# Altium schematic sheet External_Camera_HAT_Peripherals.SchDoc: Peripherals
size B; Date: 1/18/2024; Author: Robert Pafford; Organization: ORGANIZATION; Address1: ADDRESS 1; Address2: ADDRESS 2; Address3: ADDRESS 3; Address4: ADDRESS 4; Revision: -; SheetNumber: 3; SheetTotal: 4; ENG_APP_DATE: --/--/--; DSN_APP_DATE: --/--/--; CHK_APP_DATE: --/--/--
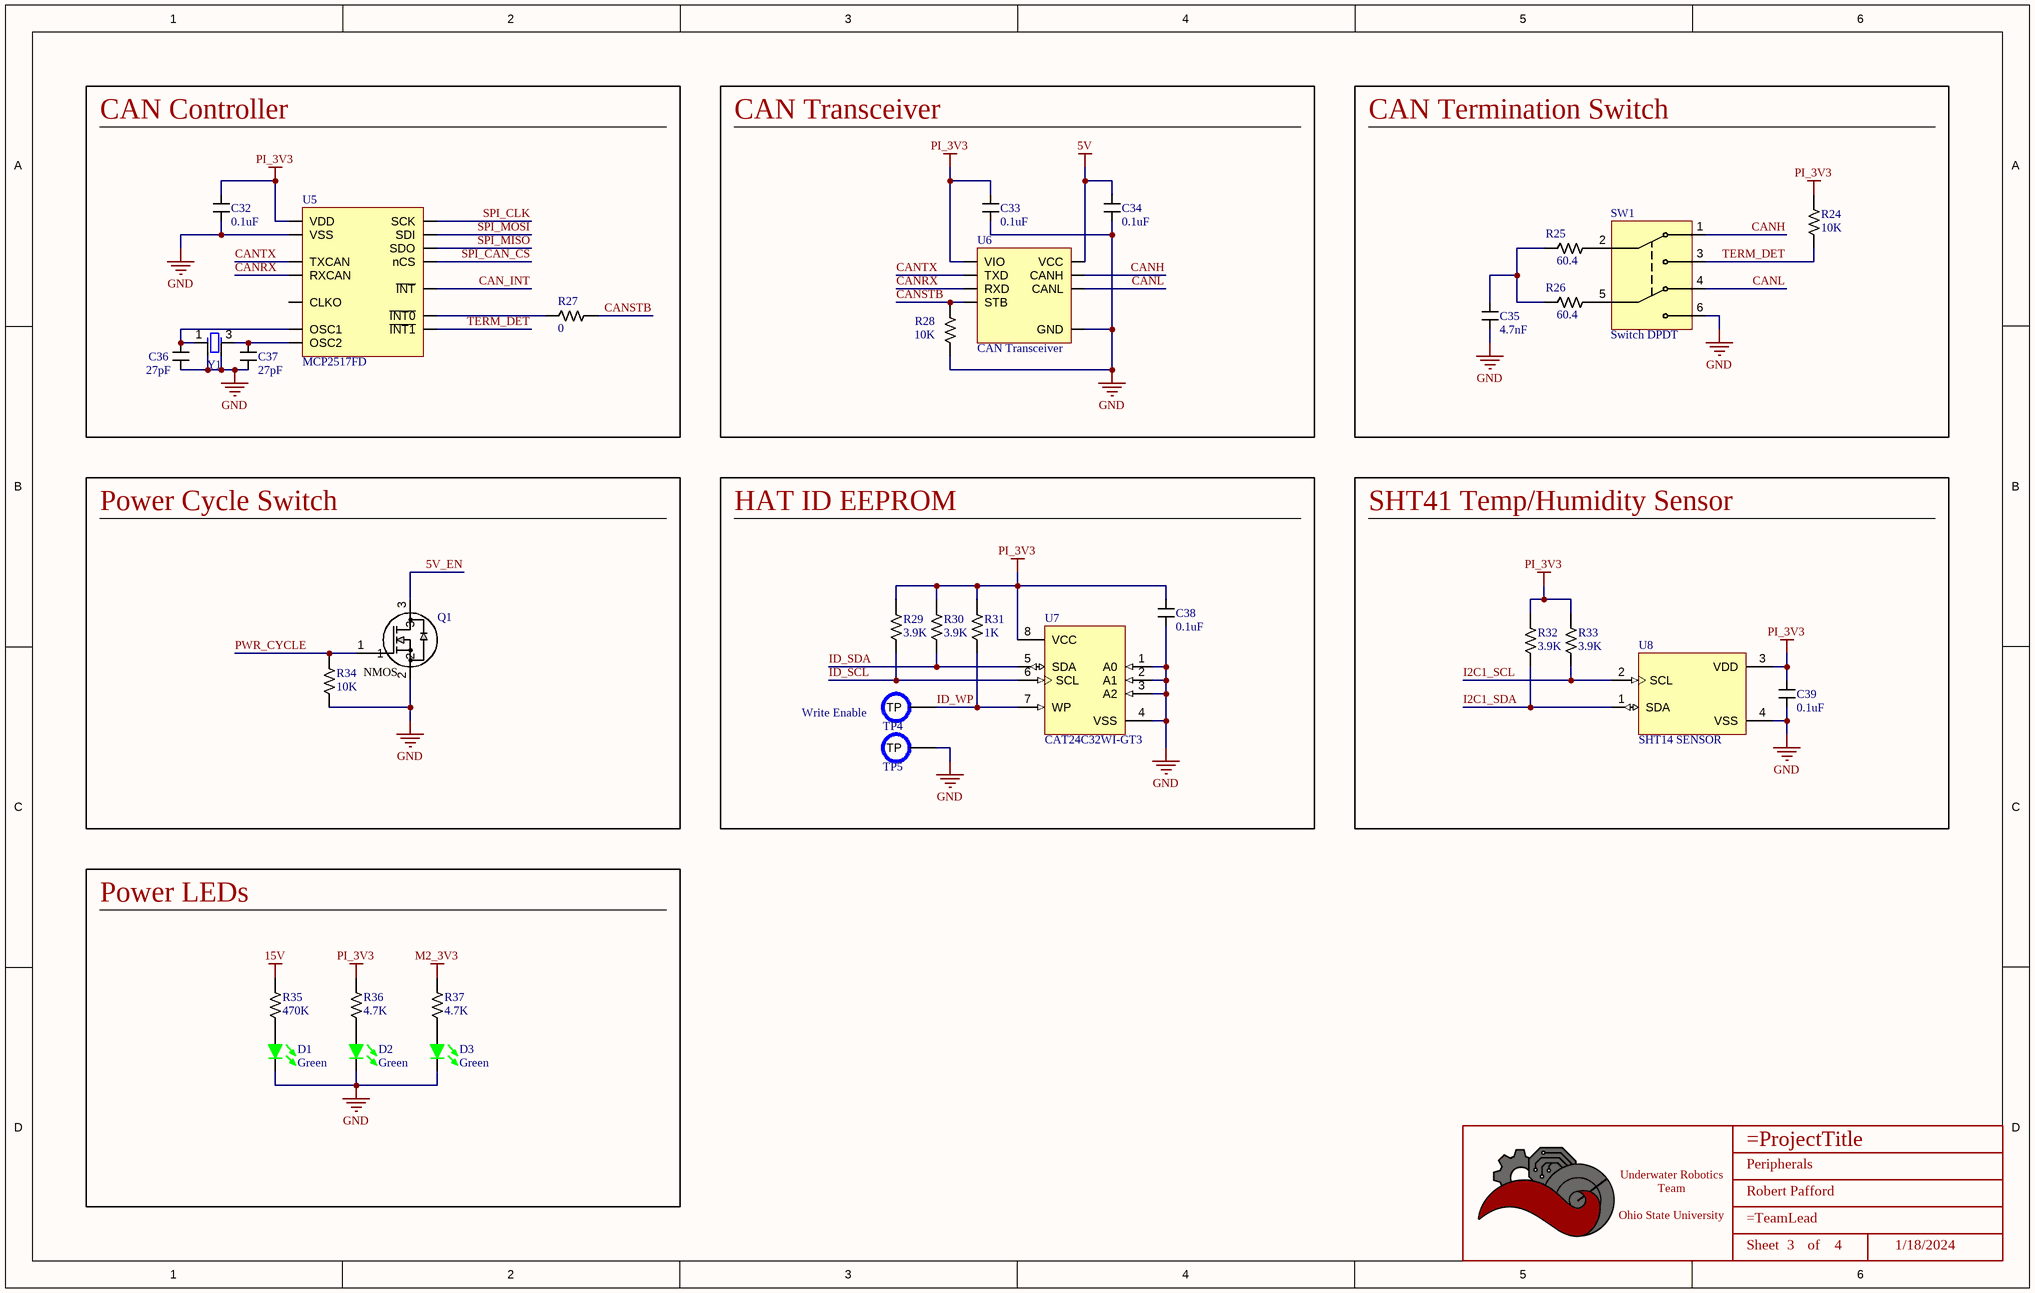
[diagram p0: External_Camera_HAT_Peripherals.SchDoc]

## Parts
*  Title_Block  [LOGO]  (value not drawn)  (graphical)
C32  value 0.1uF  [CAPACITOR_0402]  (hidden comment: 100nF Ceramic 25V)
C33  value 0.1uF  [CAPACITOR_0402]  (hidden comment: 100nF Ceramic 25V)
C34  value 0.1uF  [CAPACITOR_0402]  (hidden comment: 100nF Ceramic 25V)
C35  value 4.7nF  [CAPACITOR_0402]  (hidden comment: 4700pF Ceramic 25V)
C36  value 27pF  [CAPACITOR_0402]  (hidden comment: 27pF Ceramic 50V)
C37  value 27pF  [CAPACITOR_0402]  (hidden comment: 27pF Ceramic 50V)
C38  value 0.1uF  [CAPACITOR_0402]  (hidden comment: 100nF Ceramic 25V)
C39  value 0.1uF  [CAPACITOR_0402]  (hidden comment: 100nF Ceramic 25V)
D1  Color: Green  [LED_0603]  (hidden comment: 150060GS75000)
D2  Color: Green  [LED_0603]  (hidden comment: 150060GS75000)
D3  Color: Green  [LED_0603]  (hidden comment: 150060GS75000)
Q1  MOSFET N-CH 30V 5.8A SOT-23-3  [SOT-23-3]  (value not drawn)
R24  Value  (Ohms): 10K  [RESISTOR_0402]  (hidden comment: 10k Ohm 1% 1/16W)
R25  Value  (Ohms): 60.4  [RESISTOR_0402]  (hidden comment: 60.4 Ohm 1% 1/16W)
R26  Value  (Ohms): 60.4  [RESISTOR_0402]  (hidden comment: 60.4 Ohm 1% 1/16W)
R27  Value  (Ohms): 0  [RESISTOR_0402]  (hidden comment: 0 Ohm 1% 1/16W)
R28  Value  (Ohms): 10K  [RESISTOR_0402]  (hidden comment: 10k Ohm 1% 1/16W)
R29  Value  (Ohms): 3.9K  [RESISTOR_0402]  (hidden comment: 3.9k Ohm 1% 1/16W)
R30  Value  (Ohms): 3.9K  [RESISTOR_0402]  (hidden comment: 3.9k Ohm 1% 1/16W)
R31  Value  (Ohms): 1K  [RESISTOR_0402]  (hidden comment: 1k Ohm 1% 1/16W)
R32  Value  (Ohms): 3.9K  [RESISTOR_0402]  (hidden comment: 3.9k Ohm 1% 1/16W)
R33  Value  (Ohms): 3.9K  [RESISTOR_0402]  (hidden comment: 3.9k Ohm 1% 1/16W)
R34  Value  (Ohms): 10K  [RESISTOR_0402]  (hidden comment: 10k Ohm 1% 1/16W)
R35  Value  (Ohms): 470K  [RESISTOR_0603]  (hidden comment: 470k Ohm 5% 1/10W)
R36  Value  (Ohms): 4.7K  [RESISTOR_0603]  (hidden comment: 4.7k Ohm 5% 1/10W)
R37  Value  (Ohms): 4.7K  [RESISTOR_0603]  (hidden comment: 4.7k Ohm 5% 1/10W)
SW1  Switch DPDT  [CAS-220TA]
TP4  Write Enable  [TESTPOINT_1.2MM]  (no BOM)
TP5  PCB Test Point  [TESTPOINT_1.2MM]  (value not drawn)  (no BOM)
U5  MCP2517FD  [SOIC-14]
U6  CAN Transceiver  [SOIC-8]
U7  CAT24C32WI-GT3  [ONSC-SOIC-8-751BD-01_M]
U8  SHT14 SENSOR  [XDCR_SHT41-AD1B-R2]
Y1  CRYSTAL 20.0000MHZ 18PF SMD  [4-SMD, NO LEAD CRYSTAL 3.2x2.5mm]  (value not drawn)

## Blocks framed on the sheet
CAN Controller: C32 C36 C37 R27 U5 Y1
CAN Transceiver: C33 C34 R28 U6
CAN Termination Switch: C35 R24-R26 SW1
Power Cycle Switch: Q1 R34
HAT ID EEPROM: C38 R29-R31 TP4 TP5 U7
SHT41 Temp/Humidity Sensor: C39 R32 R33 U8
Power LEDs: D1-D3 R35-R37

## Nets
5V: C34.1 U6.3(VCC)
15V: R35.1
GND: C32.2 C33.2 C34.2 C35.1 C36.2 C37.2 C38.2 C39.2 D1.2 D2.2 D3.2 Q1.2 R28.2 R34.2 SW1.6 TP5.TP U5.7(VSS) U6.2(GND) U7.1(A0) U7.2(A1) U7.3(A2) U7.4(VSS) U8.4(VSS) Y1.2(GND1) Y1.4(GND1)
M2_3V3: R37.1
PI_3V3: C32.1 C33.1 C38.1 C39.1 R24.1 R29.1 R30.1 R31.1 R32.1 R33.1 R36.1 U5.14(VDD) U6.5(VIO) U7.8(VCC) U8.3(VDD)
5V_EN: Q1.3
CAN_INT: U5.4(~{INT})
CANH: SW1.1 U6.7(CANH)
CANL: SW1.4 U6.6(CANL)
CANRX: U5.2(RXCAN) U6.4(RXD)
CANSTB: R27.1 R28.1 U6.8(STB)
CANTX: U5.1(TXCAN) U6.1(TXD)
I2C1_SCL: R33.2 U8.2(SCL)
I2C1_SDA: R32.2 U8.1(SDA)
ID_SCL: R29.2 U7.6(SCL)
ID_SDA: R30.2 U7.5(SDA)
ID_WP: R31.2 TP4.TP U7.7(WP)
PWR_CYCLE: Q1.1 R34.1
SPI_CAN_CS: U5.13(nCS)
SPI_CLK: U5.10(SCK)
SPI_MISO: U5.12(SDO)
SPI_MOSI: U5.11(SDI)
TERM_DET: R24.2 SW1.3 U5.8(~{INT1})
NetC35_2: C35.2 R25.2 R26.2
NetC36_1: C36.1 U5.6(OSC1) Y1.1
NetC37_1: C37.1 U5.5(OSC2) Y1.3
NetD1_1: D1.1 R35.2
NetD2_1: D2.1 R36.2
NetD3_1: D3.1 R37.2
NetR25_1: R25.1 SW1.2
NetR26_1: R26.1 SW1.5
NetR27_2: R27.2 U5.9(~{INT0})

Not connected (* = marked no-connect by the designer): U5 3(CLKO)

## Notes on the sheet
- DWG. NO.
- REV.
- SHT.
- THIS DOCUMENT AND THE DATA DISCLOSED HEREIN OR HEREWITH IS THE PROPERTY OF ALTIUM LIMITED AND MAY BE FREELY DISTRIBUTED IN WHOLE. NO RIGHTS ARE RESERVED OR EXPRESS OR IMPLIED WARANTEE GIVEN.
- REVISION
- DESCRIPTION
- DATE
- APPROVED
- ENG:
- APPROVALS
- PROJECT
- DSN:
- CHK:
- REFERENCE DOCUMENTS
- PROJECT REVISION:
- TITLE
- DOCUMENT REVISION:
- DESIGN ITEM:
- BOM:
- FAB DWG:
- PCB DWG:
- ASSY DWG:
- SCALE:
- SIZE
- B
- CAGE CODE
- FILE NAME
- DWG NO.
- SHEET
- OF
- REV
- (in symbol AO3404A) NMOS
- (in symbol Title_Block) Underwater Robotics Team / Ohio State University; Sheet; of

## Library data of the parts
* = Title_Block: UWRT Schematic Title Block Template / Created June 2021, Dylan Trainor
C32-C34 C38 C39 = CAPACITOR_0.1uF_0402: Cap 100nF 25V +/-10% / Ceramic 0402; Made By: Robert Pafford; Tolerance: +/- 10%; Voltage: 25V; Supplier 1: Digi-Key; Supplier Part Number 1: 478-7868-1-ND
C35 = CAPACITOR_0.0047uF_0402: 4700 pF +/-10% 25V Ceramic Capacitor X7R 0402; Made By: Robert Pafford; Tolerance: +/- 10%; Voltage: 25V; Supplier 1: Digi-Key; Supplier Part Number 1: 478-6195-1-ND
C36 C37 = CAPACITOR_0.000027uF_0402: Cap 27pF 50V +/-5% / Ceramic 0402; Made By: Robert Pafford; Tolerance: +/- 5%; Voltage: 50V; Supplier 1: Digi-Key; Supplier Part Number 1: 445-5589-1-ND
D1-D3 = LED_Green_0603_3.2V: LED Green Vf= 3.2V If = 0.025A / 150060GS75000; Made By: Flip B; Forward Current: 25mA; Supplier 1: Digi-Key; ComponentLink1Description: Datasheet; ComponentLink1URL: https://www.we-online.de/katalog/datasheet/150060GS75000.pdf; Supplier Part Number 1: 732-4971-1-ND; Forward Voltage: 3.2V; Package: 0603
Q1 = AO3404A: N-Channel 30 V 5.8A (Ta) 1.4W (Ta) Surface Mount SOT-23-3; Vendor: Alpha & Omega Semiconductor Inc.; SourceLibrary: ON_Semiconductor_2020-01-13; Vgs (Max): 3V @ 5.8A, 10V; Vgs (th): 3V @ 250µA; Rds (on): 28mOhm @ 5.8A, 10V; Amp Rating: 5.8 A; FET Type: N-Channel; Package: SOT23-3L; Manufacturer _Part_Number: AO3404A; Vdss: 30V; Power Dissipation: 1.4W (Ta); Supplier 1: Digi-Key; Supplier Part Number 1: 785-1004-1-ND; Created By: Dylan T
R24 R28 R34 = RESISTOR_10K_0402: RES 10k OHM 1% 1/16W 0402; Tolerance: +/- 1%; Made By: Robert Pafford; Wattage: 1/16W; Supplier: Digikey; Digikey Part Numer: CR0603-JW-104ELFTR-ND; Supplier 1: Digi-Key; Supplier Part Number 1: YAG3436CT-ND
R25 R26 = RESISTOR_60.4_0402: RES 60.4 OHM 1% 1/16W 0402; Tolerance: +/- 1%; Made By: Robert Pafford; Wattage: 1/16W; Supplier: Digikey; Digikey Part Numer: CR0603-JW-104ELFTR-ND; Supplier 1: Digi-Key; Supplier Part Number 1: 13-AC0402FR-0760R4LCT-ND
R27 = RESISTOR_0_0402: RES 0 OHM 1% 1/16W 0402; Tolerance: +/- 1%; Made By: Robert Pafford; Wattage: 1/16W; Supplier 1: Digikey; Supplier Part Number 1: 13-AC0402FR-070RLCT-ND
R29 R30 R32 R33 = RESISTOR_3.9K_0402: RES 3.9k OHM 1% 1/16W 0402; Tolerance: +/- 1%; Made By: Robert Pafford; Wattage: 1/16W; Supplier 1: Digikey; Supplier Part Number 1: YAG3484CT-ND
R31 = RESISTOR_1K_0402: RES 1k OHM 1% 1/16W 0402; Tolerance: +/- 1%; Made By: Robert Pafford; Wattage: 1/16W; Supplier: Digikey; Digikey Part Numer: CR0603-JW-104ELFTR-ND; Supplier 1: Digi-Key; Supplier Part Number 1: 13-AC0402FR-131KLCT-ND
R35 = RESISTOR_470K_0603: RES 470k OHM 5% 1/10W 0603; Tolerance: +/- 5%; Made By: Robert P; ComponentLink1Description: Datasheet; ComponentLink1URL: https://www.bourns.com/docs/product-datasheets/CRxxxxx.pdf; Wattage: 1/10W; Supplier 1: Digi-Key; Supplier Part Number 1: RMCF0603JT470KCT-ND
R36 R37 = RESISTOR_4.7K_0603: RES 4.7k OHM 5% 1/10W 0603; Tolerance: +/- 5%; Made By: Robert Pafford; Wattage: 1/10W; Supplier: Digikey; Digikey Part Numer: CR0603-JW-104ELFTR-ND; Supplier 1: Digi-Key; Supplier Part Number 1: RMCF0603JT4K70CT-ND
SW1 = CAS-220TA_CAN_TERM: GOLD SWITCH FLUSH SLIDE DPDT 100MA 6V; Made By: Robert Pafford; Voltage Rating: 6VDC; Current Rating: 100 mA; Switch Function: DPDT; Contact Finish: Gold; Supplier 1: Digi-Key; Supplier Part Number 1: CAS220JCT-ND
TP4 = TESTPOINT: PCB Test Point; Made By: Robert Pafford
TP5 = TESTPOINT: Made By: Robert Pafford
U5 = MCP2517FD: CANbus Controller CAN 2.0 SPI Interface 14-SOIC; Made By: Robert Pafford; Max FD Rate: 8 Mbps
U6 = TJA1442AT: CAN Interface IC High-Speed CAN Transceiver with Standby Mode; Made By: Robert Pafford; Max Data Rate: 5Mbps; Supplier 1: Mouser; Supplier Part Number 1: 771-TJA1442AT/0Z
U7 = CMP-1679-00009-1: I2C CMOS Serial EEPROM, 32 Kb, 1.7 to 5.5 V, -40 to 85 degC, 8-Pin SOIC (751BD), RoHS, Tape and Reel; Case\Package: TO-226-3; hFE Min: 100; Elements: 1; Max Power Dissipation: 625 mW; Frequency: 300 MHz; Vce Max: 1 V; ComponentLink1URL: http://www.onsemi.com/; Mount: Through Hole; REACH SVHC: No SVHC; Packaging: Bulk; Height: 5.33 mm; PackageDescription: 8-Pin Small Outline Integrated Circuit, Body 4.9 x 3.9 mm, Pitch 1.27 mm; ComponentLink2Description: Datasheet; DatasheetVersion: Rev. 24, 06/2015; ComponentLink1Description: Manufacturer URL; PackageReference: SOIC-8-751BD-01; Length: 5.2 mm; ComponentLink2URL: http://www.onsemi.com/pub_link/Collateral/CAT24C32-D.PDF; Pins: 3; Min Operating Temperature: -55 degC; ComponentLink3URL: http://www.onsemi.com/pub_link/Collateral/751BD.PDF; Weight: 0.006314 oz; Max Operating Temperature: 150 degC; Package Quantity: 1000; ComponentLink3Description: Package Specification; Width: 4.19 mm; RoHSCompliant: true; Radiation Hardening: No
U8 = SHT41-AD1B-R2: Digital Relative Humidity Temperature Sensor, Â±1.8 / max 2.5 %RH, Â±0.2 Â°C, Ultra-Low-Power; MF: Sensirion; Price: None; SnapEDA_Link: https://www.snapeda.com/parts/SHT41-AD1B-R2/Sensirion/view-part/?ref=snap; MP: SHT41-AD1B-R2; Purchase-URL: https://pricing.snapeda.com/search/part/SHT41-AD1B-R2/?ref=eda; Value: *; Availability: In Stock; Package: None; Check_prices: https://www.snapeda.com/parts/SHT41-AD1B-R2/Sensirion/view-part/?ref=eda; Supplier 1: Digi-Key; Supplier Part Number 1: 1649-SHT41-AD1B-R2CT-ND
Y1 = CRYSTAL_20MHz_SMD: 20 MHz ±20ppm Crystal 18pF 100 Ohms 4-SMD, No Lead (3.2x2.5mm); Made By: Robert Pafford; Frequency: 20 MHz; ESR: 70 Ohms; Load Capacitance: 18pF; Supplier 1: Digikey; Supplier Part Number 1: 2151-RH100-20.000-18-2020-TRCT-ND